# EasyEDA schematic PCB_sid_pm.json
TITLE: Sid circuitry schematic; REV: 1.0; Date: 2022-02-09; Sheet: 1/1; Company: ECAM 4MIN
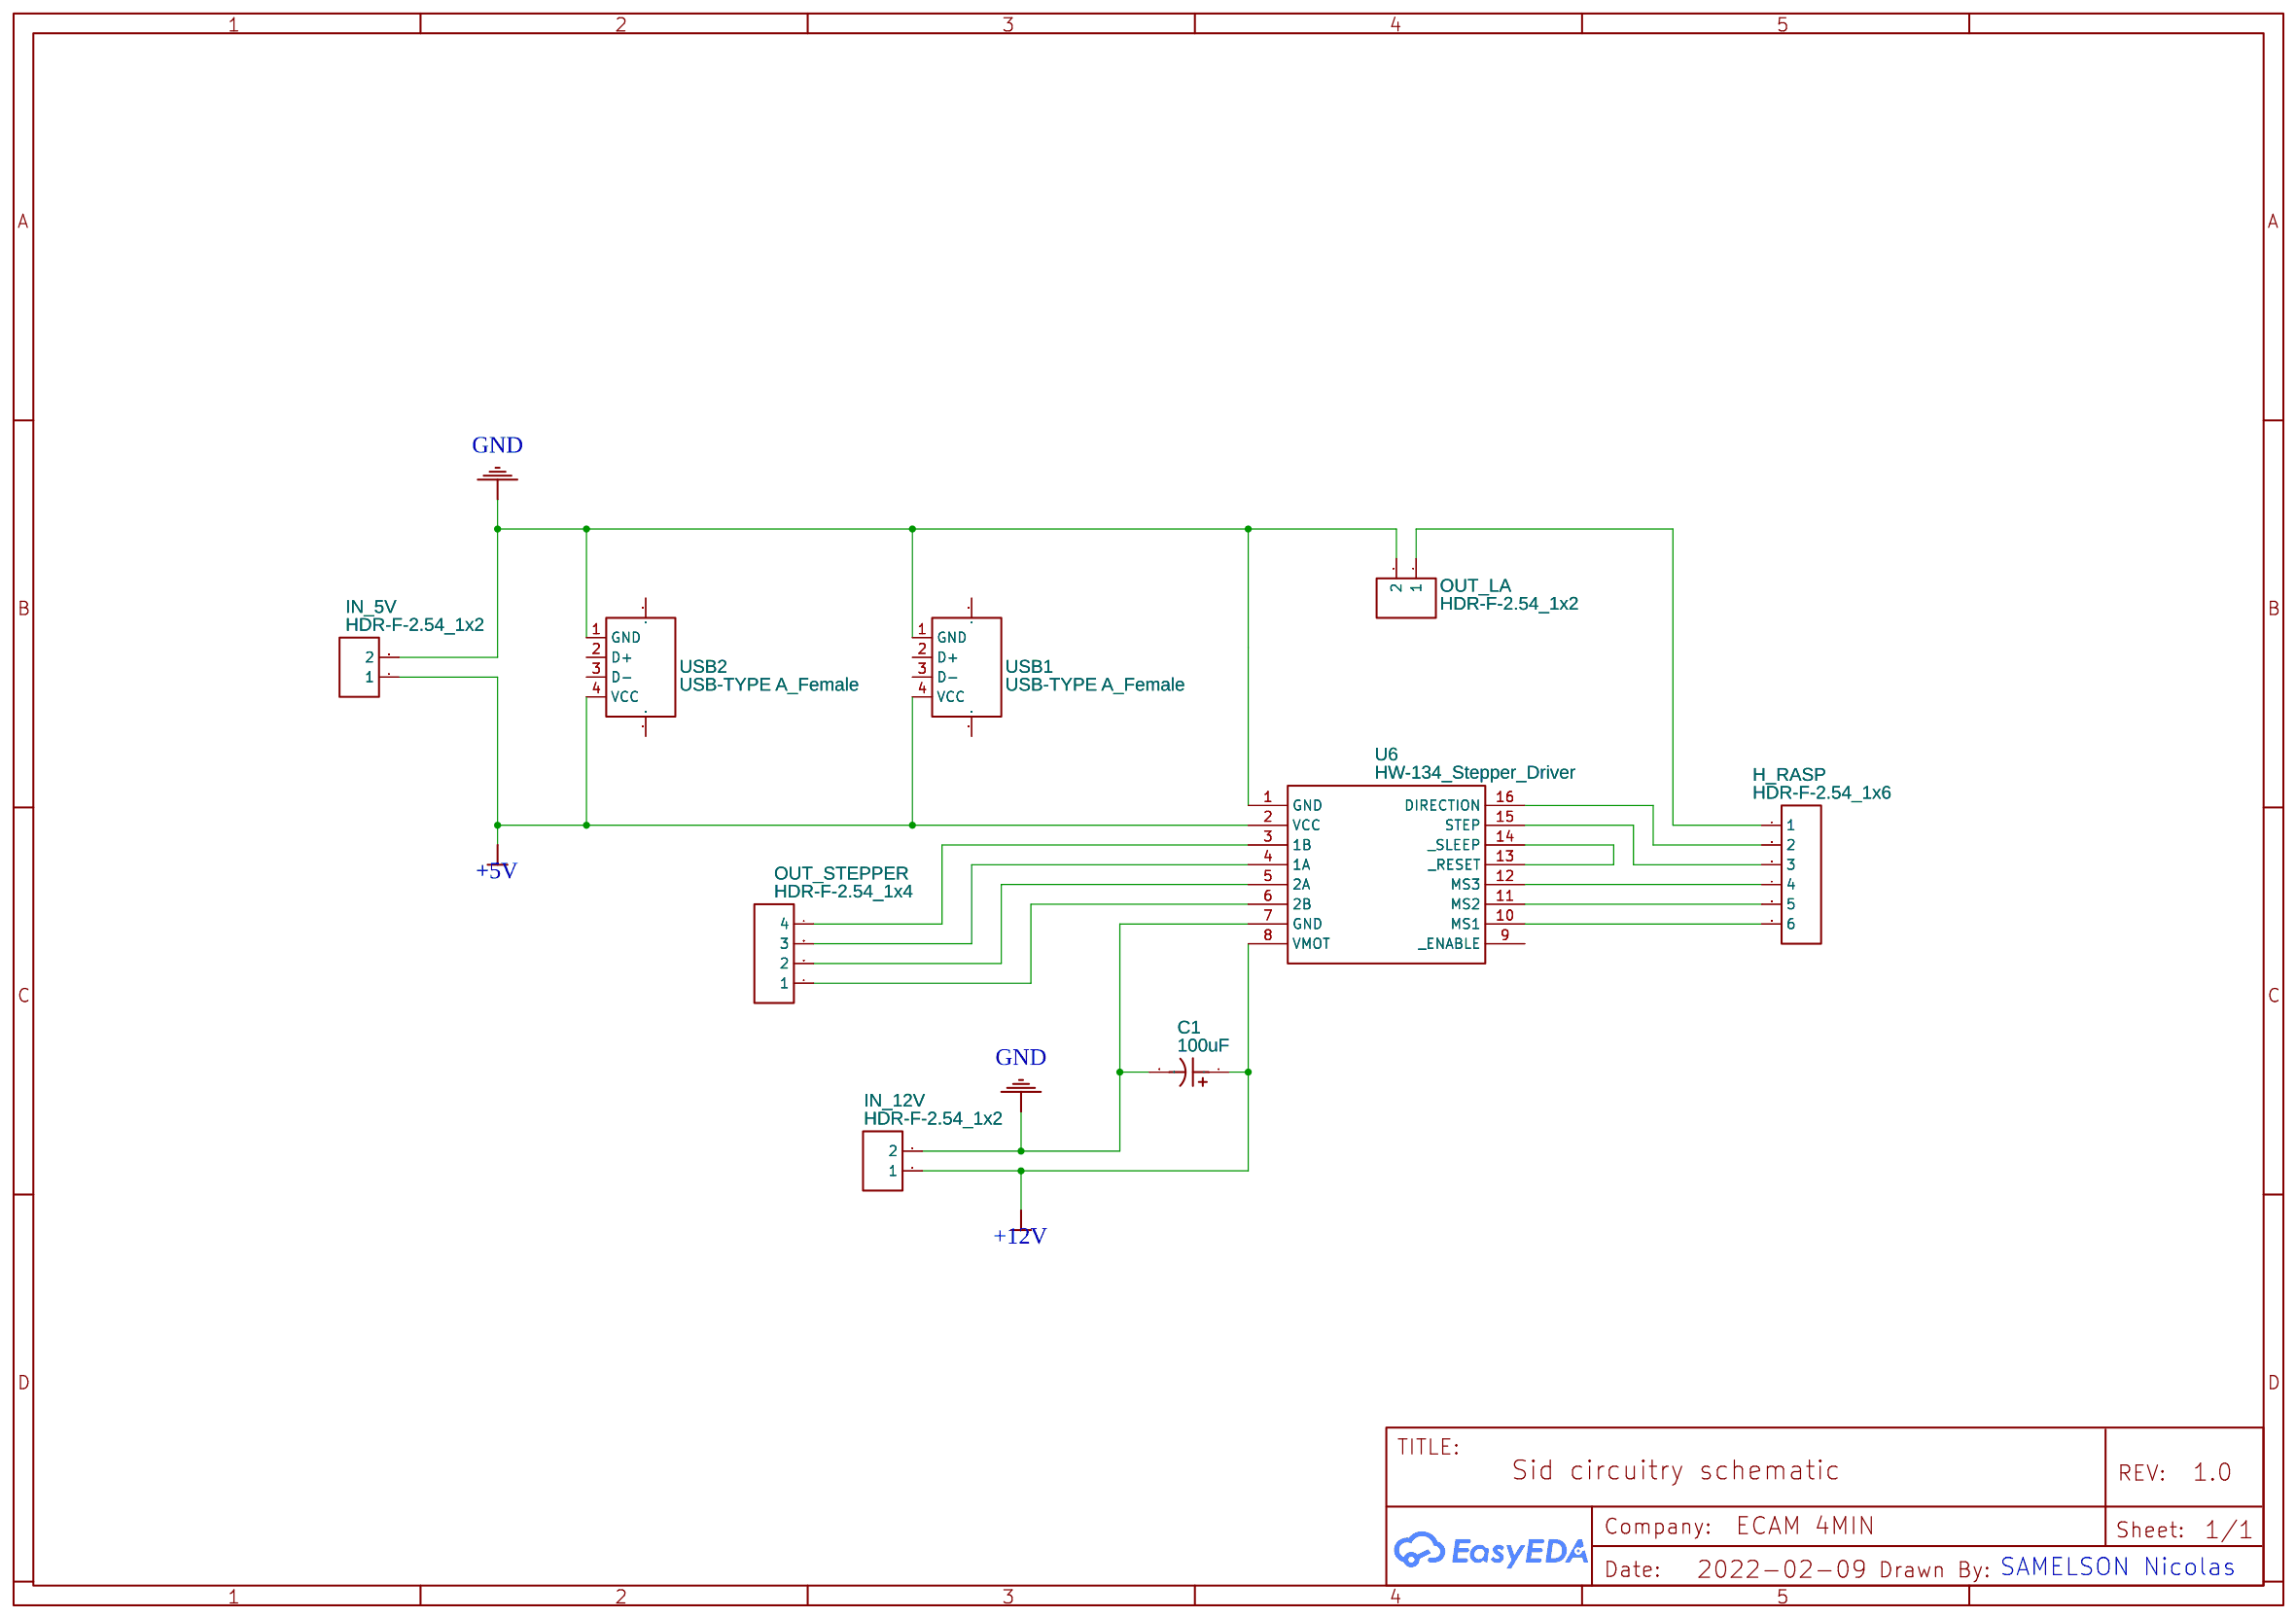
[diagram p0: schematic sheet]

## Parts
C1  100uF  [CAP-TH_BD8.0-P3.50-D0.6-FD]
H_RASP  HDR-F-2.54_1x6  [HDR-F-2.54_1X6]
IN_5V  HDR-F-2.54_1x2  [HDR-F-2.54_1X2]
IN_12V  HDR-F-2.54_1x2  [HDR-F-2.54_1X2]
OUT_LA  HDR-F-2.54_1x2  [HDR-F-2.54_1X2]
OUT_STEPPER  HDR-F-2.54_1x4  [HDR-F-2.54_1X4]
U6  HW-134_Stepper_Driver  [HW-134_STEPPER_DRIVER]
USB1  USB-TYPE A_Female  [USB-A-SMD_USB-M-32-F]
USB2  USB-TYPE A_Female  [USB-A-SMD_USB-M-32-F]

## Library data of the parts
C1 = ECA1HHG101: Supplier: LCSC; Supplier Part: C713160; Manufacturer: PANASONIC(松下); JLCPCB Part Class: Extended Part; Contributor: LCSC
H_RASP = HDR-F-2.54_1x6: Supplier Part: C40877; Supplier: LCSC; Contributor: LCEDA_Lib
IN_5V IN_12V OUT_LA = HDR-F-2.54_1x2: Supplier Part: C49661; Supplier: LCSC; Contributor: LCEDA_Lib
OUT_STEPPER = HDR-F-2.54_1x4: Supplier Part: C225501; Supplier: LCSC; Contributor: LCEDA_Lib
U6 = HW-134_Stepper_Driver: Contributor: chjrwithac
USB1 = USB-TYPE A_Female: Supplier Part: C42605; Supplier: LCSC; Manufacturer: ValuePro; Contributor: LCEDA_Lib
USB2 = USB-TYPE A_Female: Supplier Part: C42605; Supplier: LCSC; Manufacturer: ValuePro; Contributor: LCEDA_Lib; Package Display: No

## Nets
+5V: IN_5V.1 U6.2(VCC) USB1.4(VCC) USB2.4(VCC)
+12V: C1.1 IN_12V.1 U6.8(VMOT)
GND: C1.2 IN_5V.2 IN_12V.2 OUT_LA.2 U6.1(GND) U6.7(GND) USB1.1(GND) USB2.1(GND)
Net-(H_RASP-1): H_RASP.1 OUT_LA.1
Net-(H_RASP-2): H_RASP.2 U6.16(DIRECTION)
Net-(H_RASP-3): H_RASP.3 U6.15(STEP)
Net-(H_RASP-4): H_RASP.4 U6.12(MS3)
Net-(H_RASP-5): H_RASP.5 U6.11(MS2)
Net-(H_RASP-6): H_RASP.6 U6.10(MS1)
Net-(OUT_STEPPER-1): OUT_STEPPER.1 U6.6(2B)
Net-(OUT_STEPPER-2): OUT_STEPPER.2 U6.5(2A)
Net-(OUT_STEPPER-3): OUT_STEPPER.3 U6.4(1A)
Net-(OUT_STEPPER-4): OUT_STEPPER.4 U6.3(1B)
Net-(U6-13): U6.13(_RESET) U6.14(_SLEEP)

Not connected (* = marked no-connect by the designer): U6 9(_ENABLE); USB1 2(D+) 3(D-) 5 6; USB2 2(D+) 3(D-) 5 6

## Notes on the sheet
- SAMELSON Nicolas
